# Altium schematic sheet Sheet1.SchDoc
size A4; SheetNumber: 1; SheetTotal: 1; SPICEModelCacheDERXHLLJ: <root> / <DocumentId>DERXHLLJ</DocumentId> / </root>
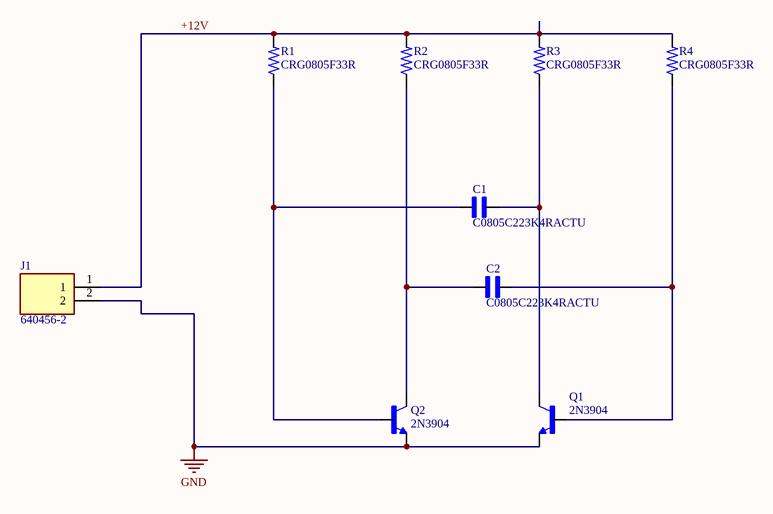
[diagram p0: Sheet1.SchDoc]

## Parts
C1  C0805C223K4RACTU  [CAPC2012X88N]
C2  C0805C223K4RACTU  [CAPC2012X88N]
J1  640456-2  [TE_640456-2]
Q1  2N3904  [TO92254P460H750-3]
Q2  2N3904  [TO92254P460H750-3]
R1  CRG0805F33R  [RESC2012X65N]
R2  CRG0805F33R  [RESC2012X65N]
R3  CRG0805F33R  [RESC2012X65N]
R4  CRG0805F33R  [RESC2012X65N]

## Nets
GND: J1.2 Q1.1(E) Q2.1(E)
+12V: J1.1 R1.2 R2.2 R3.2 R4.2
NetC1_1: C1.1 Q1.3(C) R3.1
NetC1_2: C1.2 Q2.2(B) R1.1
NetC2_1: C2.1 Q1.2(B) R4.1
NetC2_2: C2.2 Q2.3(C) R2.1

## Library data of the parts
C1 C2 = C0805C223K4RACTU: Capacitor, Ceramic, 22nF, 16VDC, 10-% Tol, 10+% Tol, X7R-TC Code, -15, 15%-TC; MF: KEMET; SnapEDA_Link: https://www.snapeda.com/parts/C0805C223K4RACTU/KEMET/view-part/?ref=snap; Package: 805-2 KEMET; Value: *; MP: C0805C223K4RACTU; Check_prices: https://www.snapeda.com/parts/C0805C223K4RACTU/KEMET/view-part/?ref=eda
J1 = 640456-2: Header Friction Lock MTA-100 2 250 VAC Polyester Tin Copper Alloy Tin | TE Connectivity 640456-2; SnapEDA_Link: https://www.snapeda.com/parts/640456-2/TE+Connectivity+AMP+Connectors/view-part/?ref=snap; Package: None; Value: *; MF: TE Connectivity; MP: 640456-2; Check_prices: https://www.snapeda.com/parts/640456-2/TE+Connectivity+AMP+Connectors/view-part/?ref=eda
Q1 Q2 = 2N3904: BJT, TO-92, 40V, 200mA, NPN, 0.625W, 150Â°C; MF: Diotec Semiconductor; SnapEDA_Link: https://www.snapeda.com/parts/2N3904/Diotec/view-part/?ref=snap; Package: TO-92 Diotec; Value: *; MP: 2N3904; Check_prices: https://www.snapeda.com/parts/2N3904/Diotec/view-part/?ref=eda
R1-R4 = CRG0805F33R: Fixed Resistors; MF: TE Connectivity; Price: None; MP: CRG0805F33R; Package: 0805; Value: *; Purchase-URL: https://pricing.snapeda.com/search/part/CRG0805F33R/?ref=eda; Check_prices: https://www.snapeda.com/parts/CRG0805F33R/TE+Connectivity+Passive+Product/view-part/?ref=eda; Availability: In Stock; EU_RoHS_Compliance: Compliant with Exemptions; SnapEDA_Link: https://www.snapeda.com/parts/CRG0805F33R/TE+Connectivity+Passive+Product/view-part/?ref=snap